# EAGLE schematic 8ModuleBoard_vr2 (EAGLE 6.3)
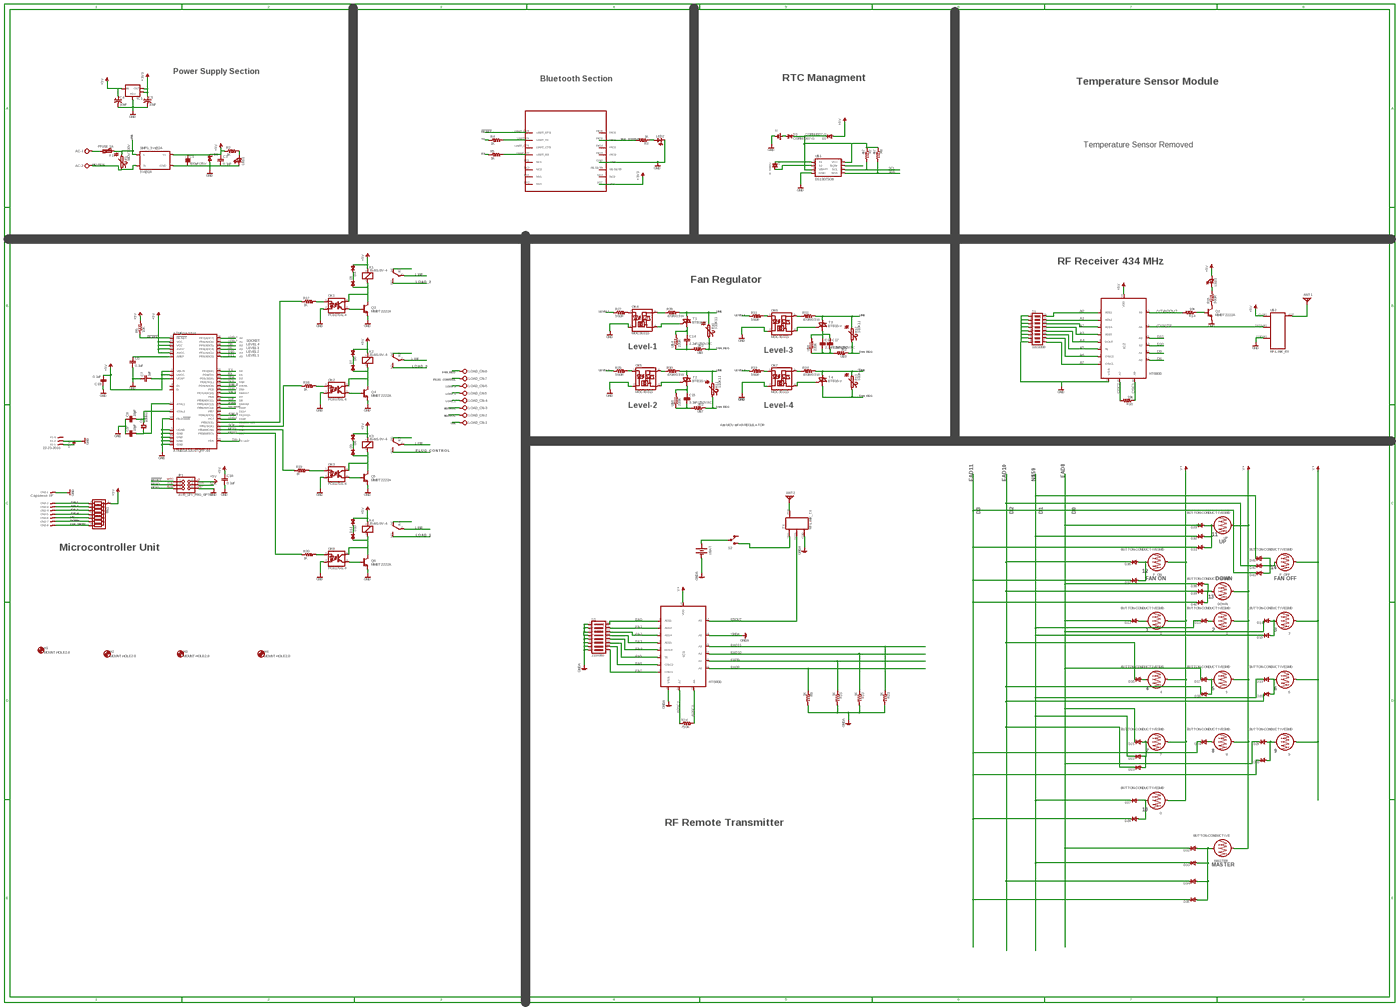
[diagram p0: schematic, sheet 1, overview]
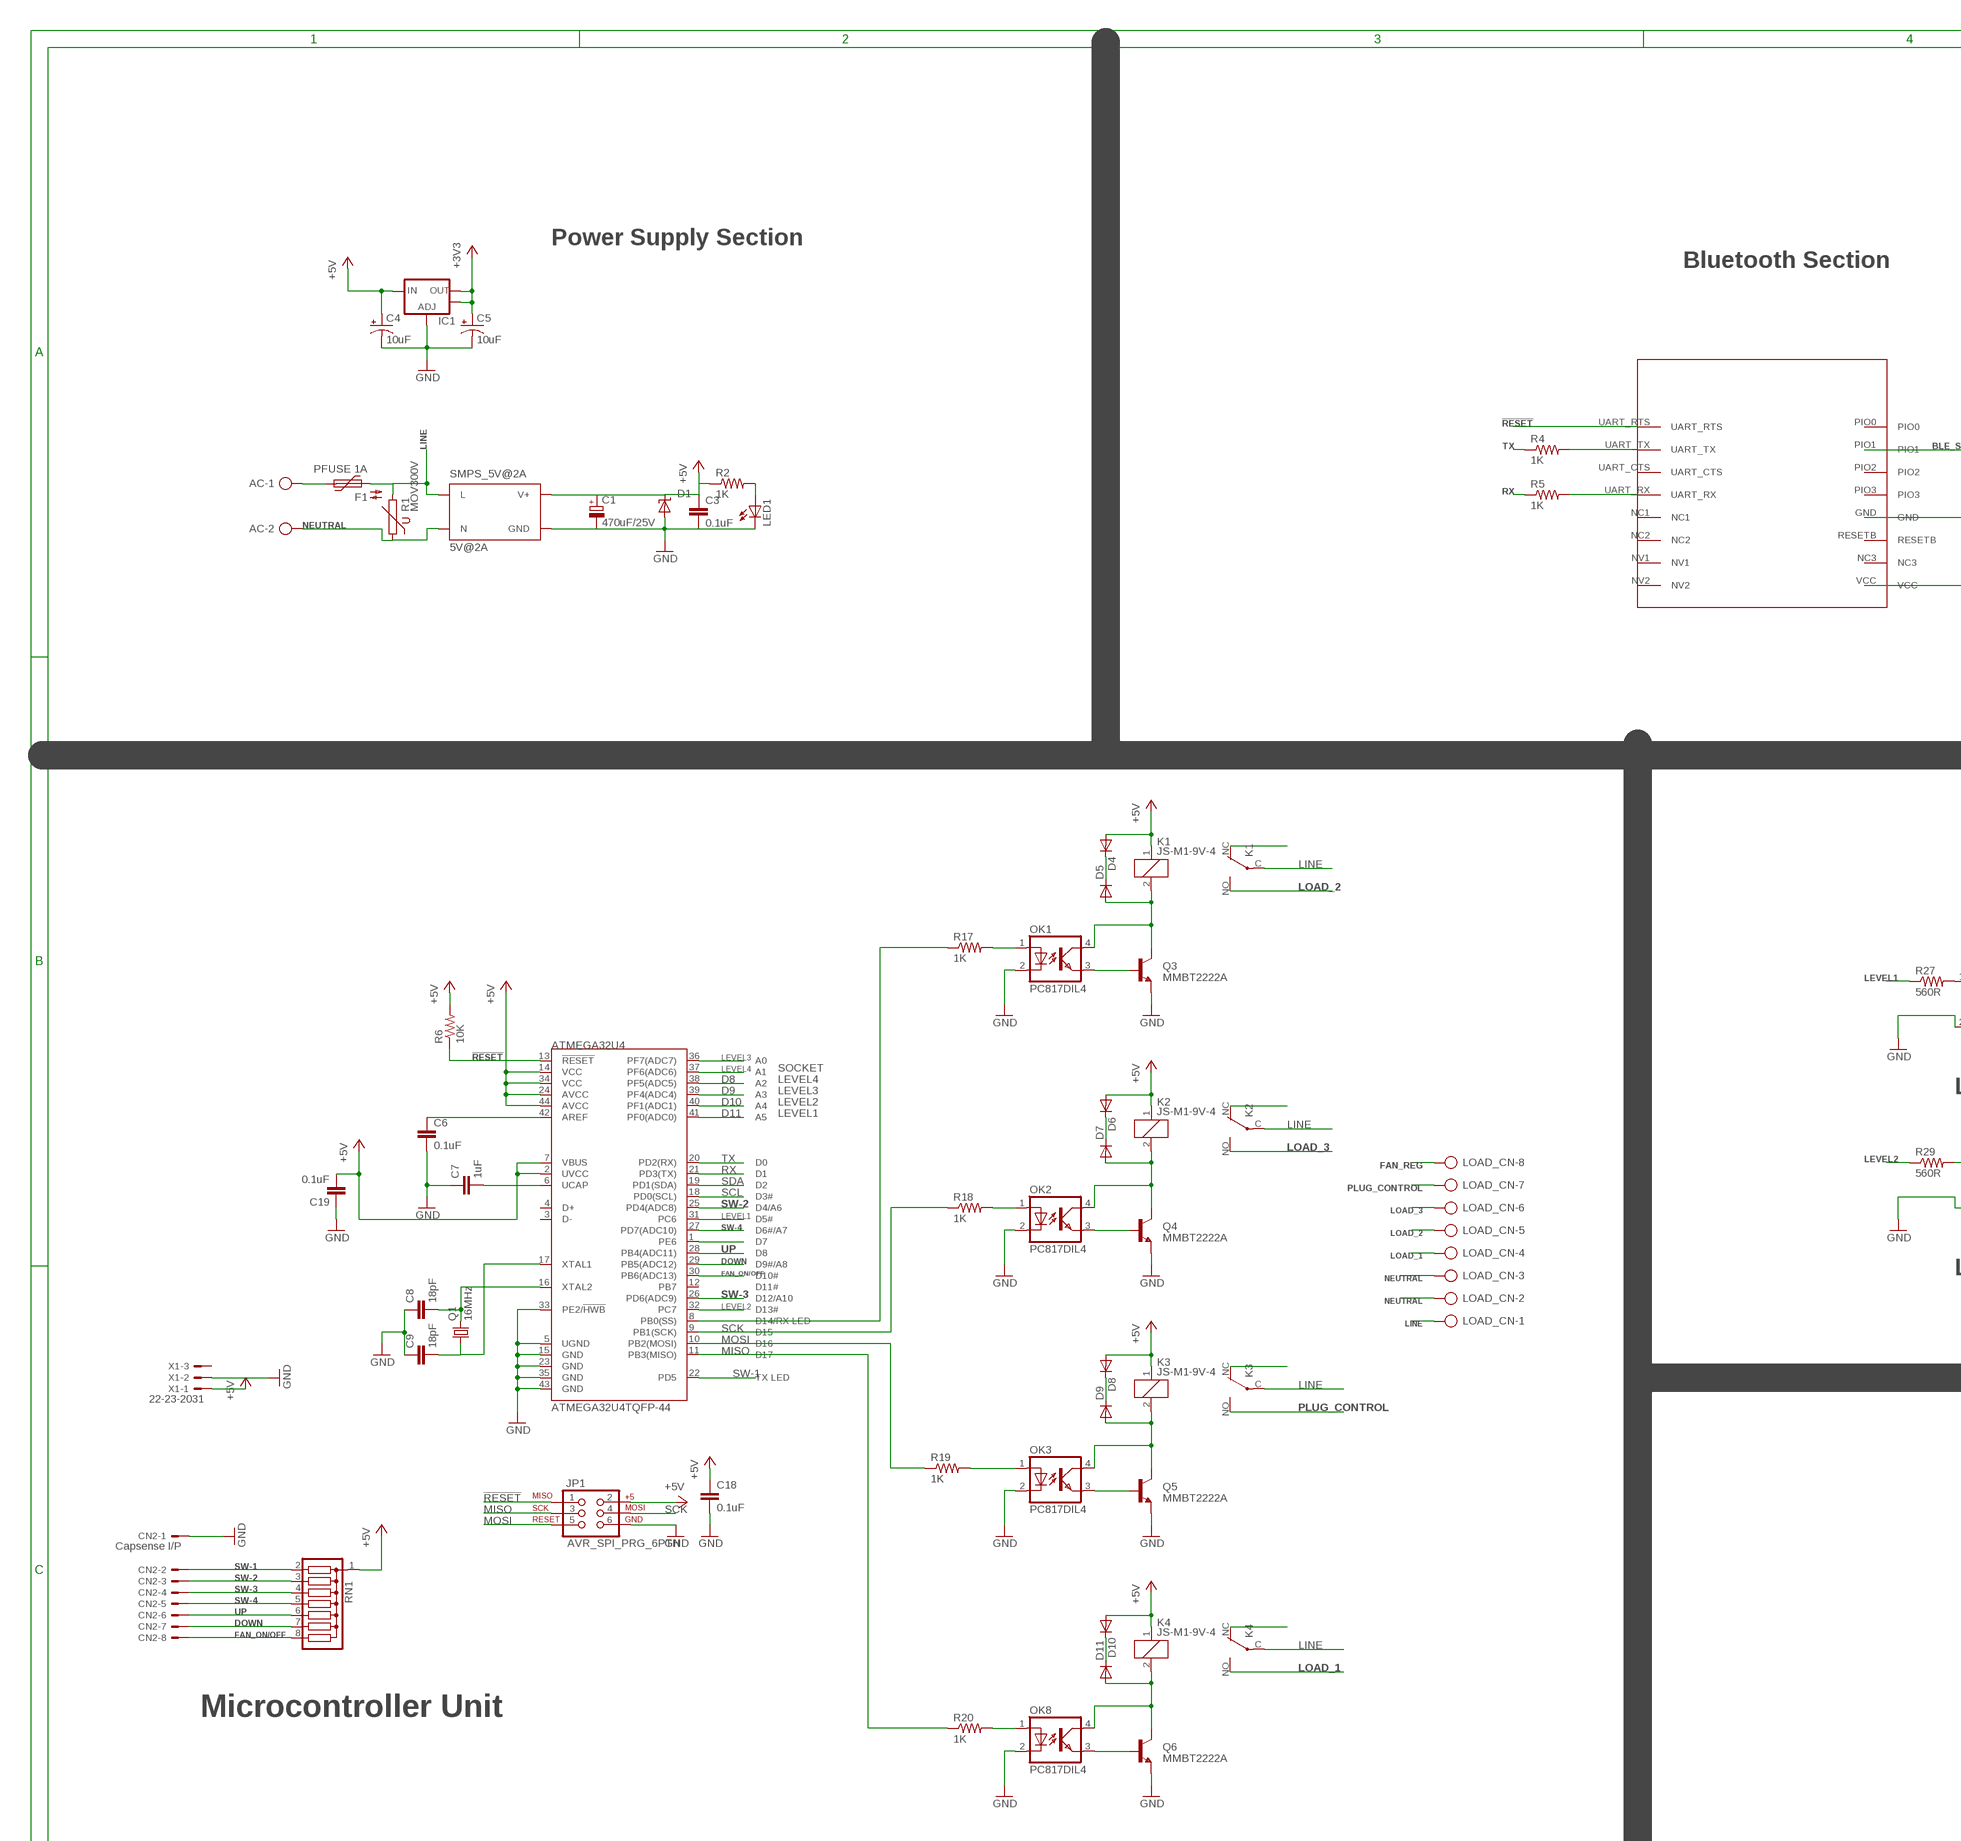
[diagram p1: schematic, sheet 1, part 1 of 4]
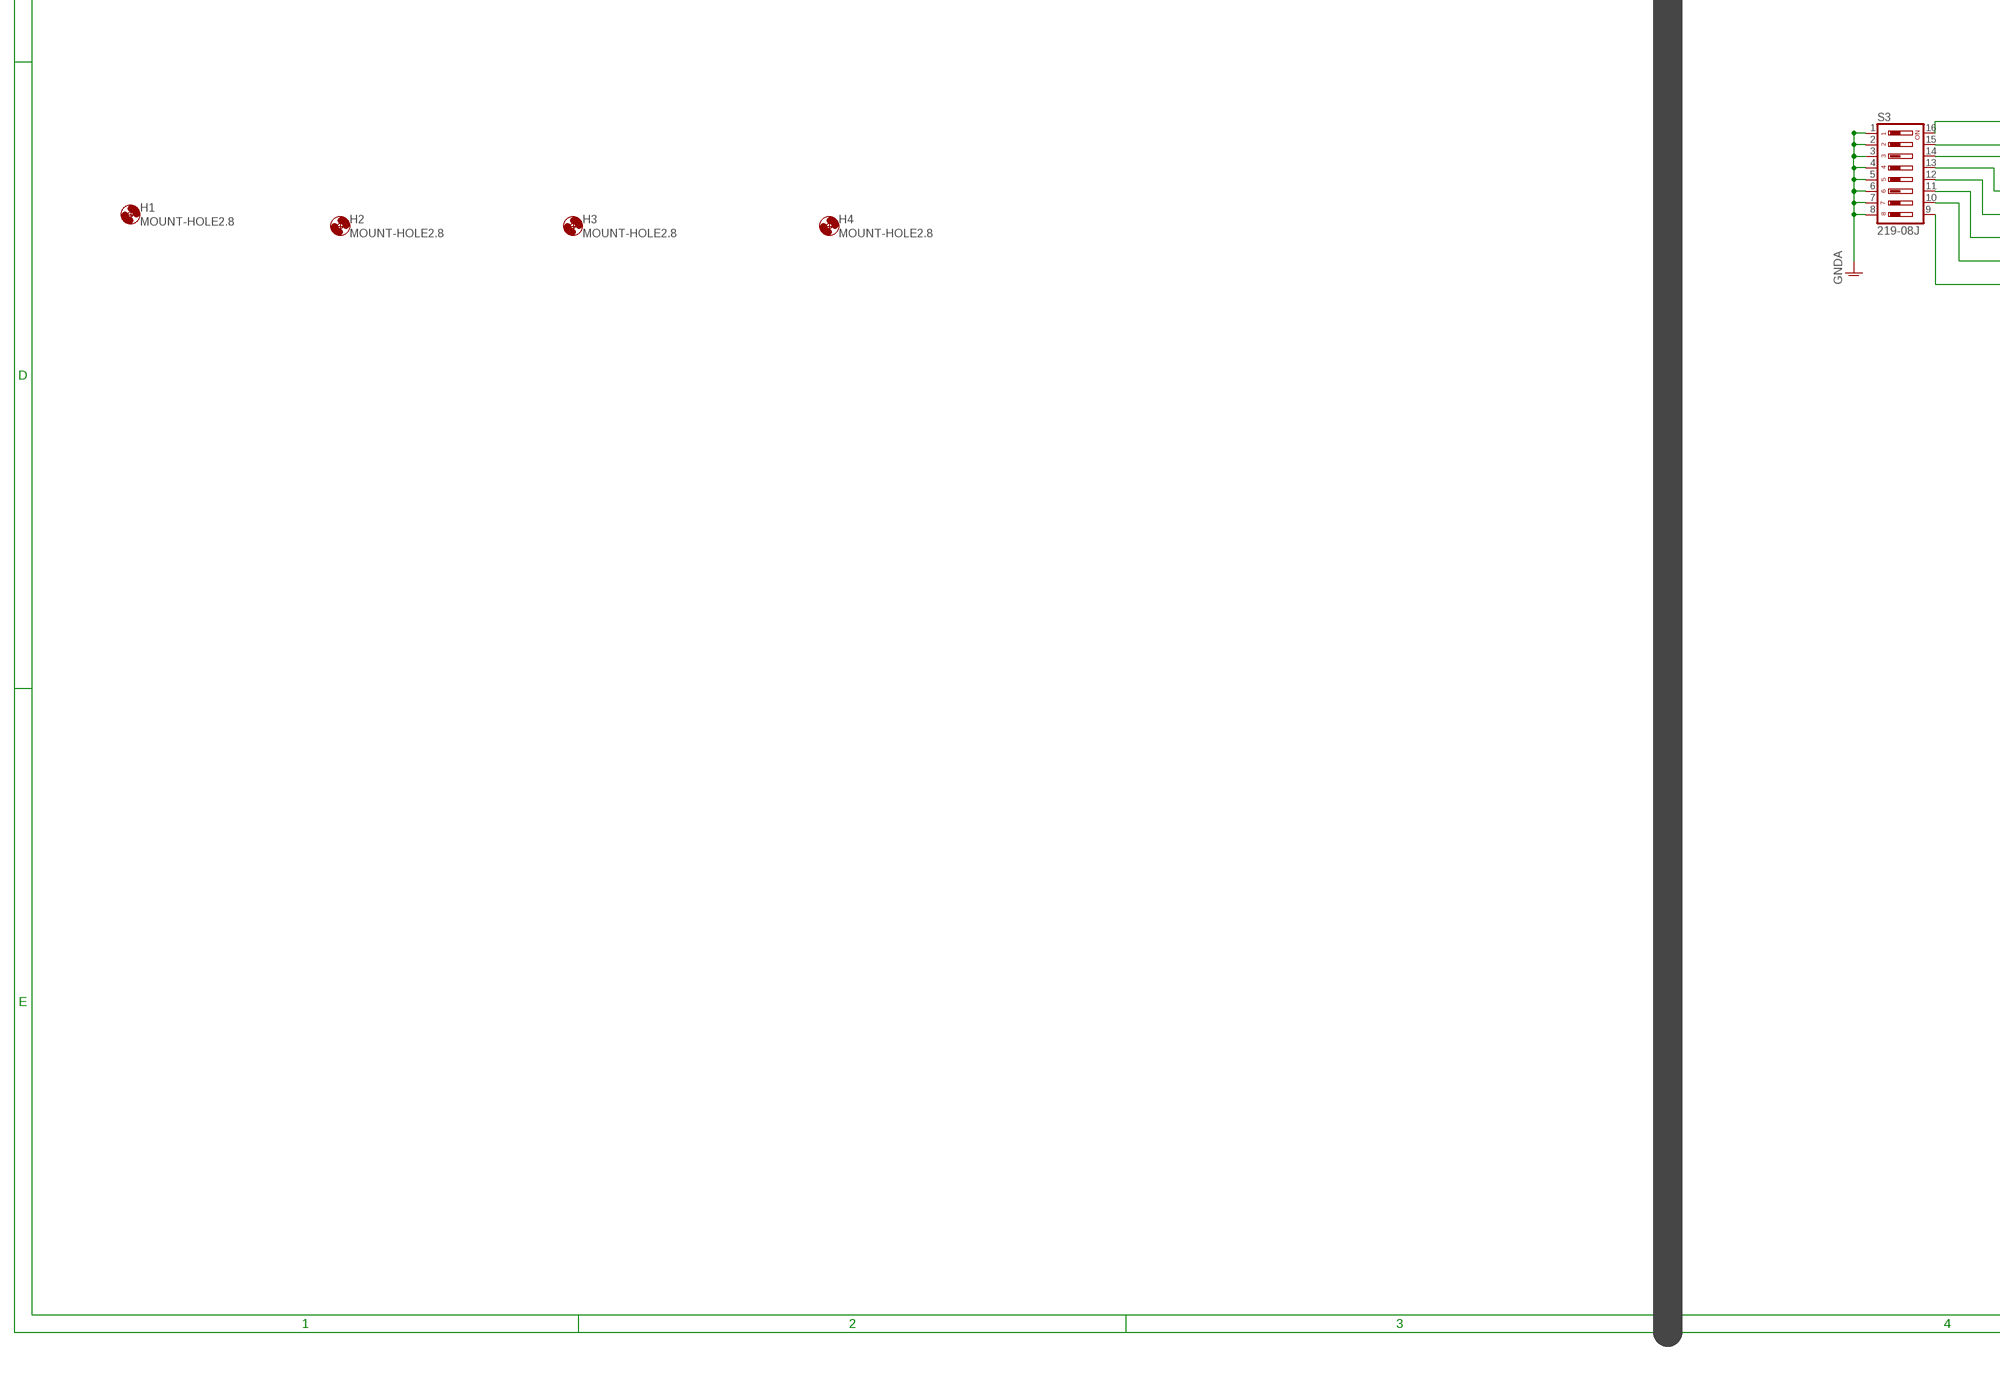
[diagram p2: schematic, sheet 1, part 2 of 4]
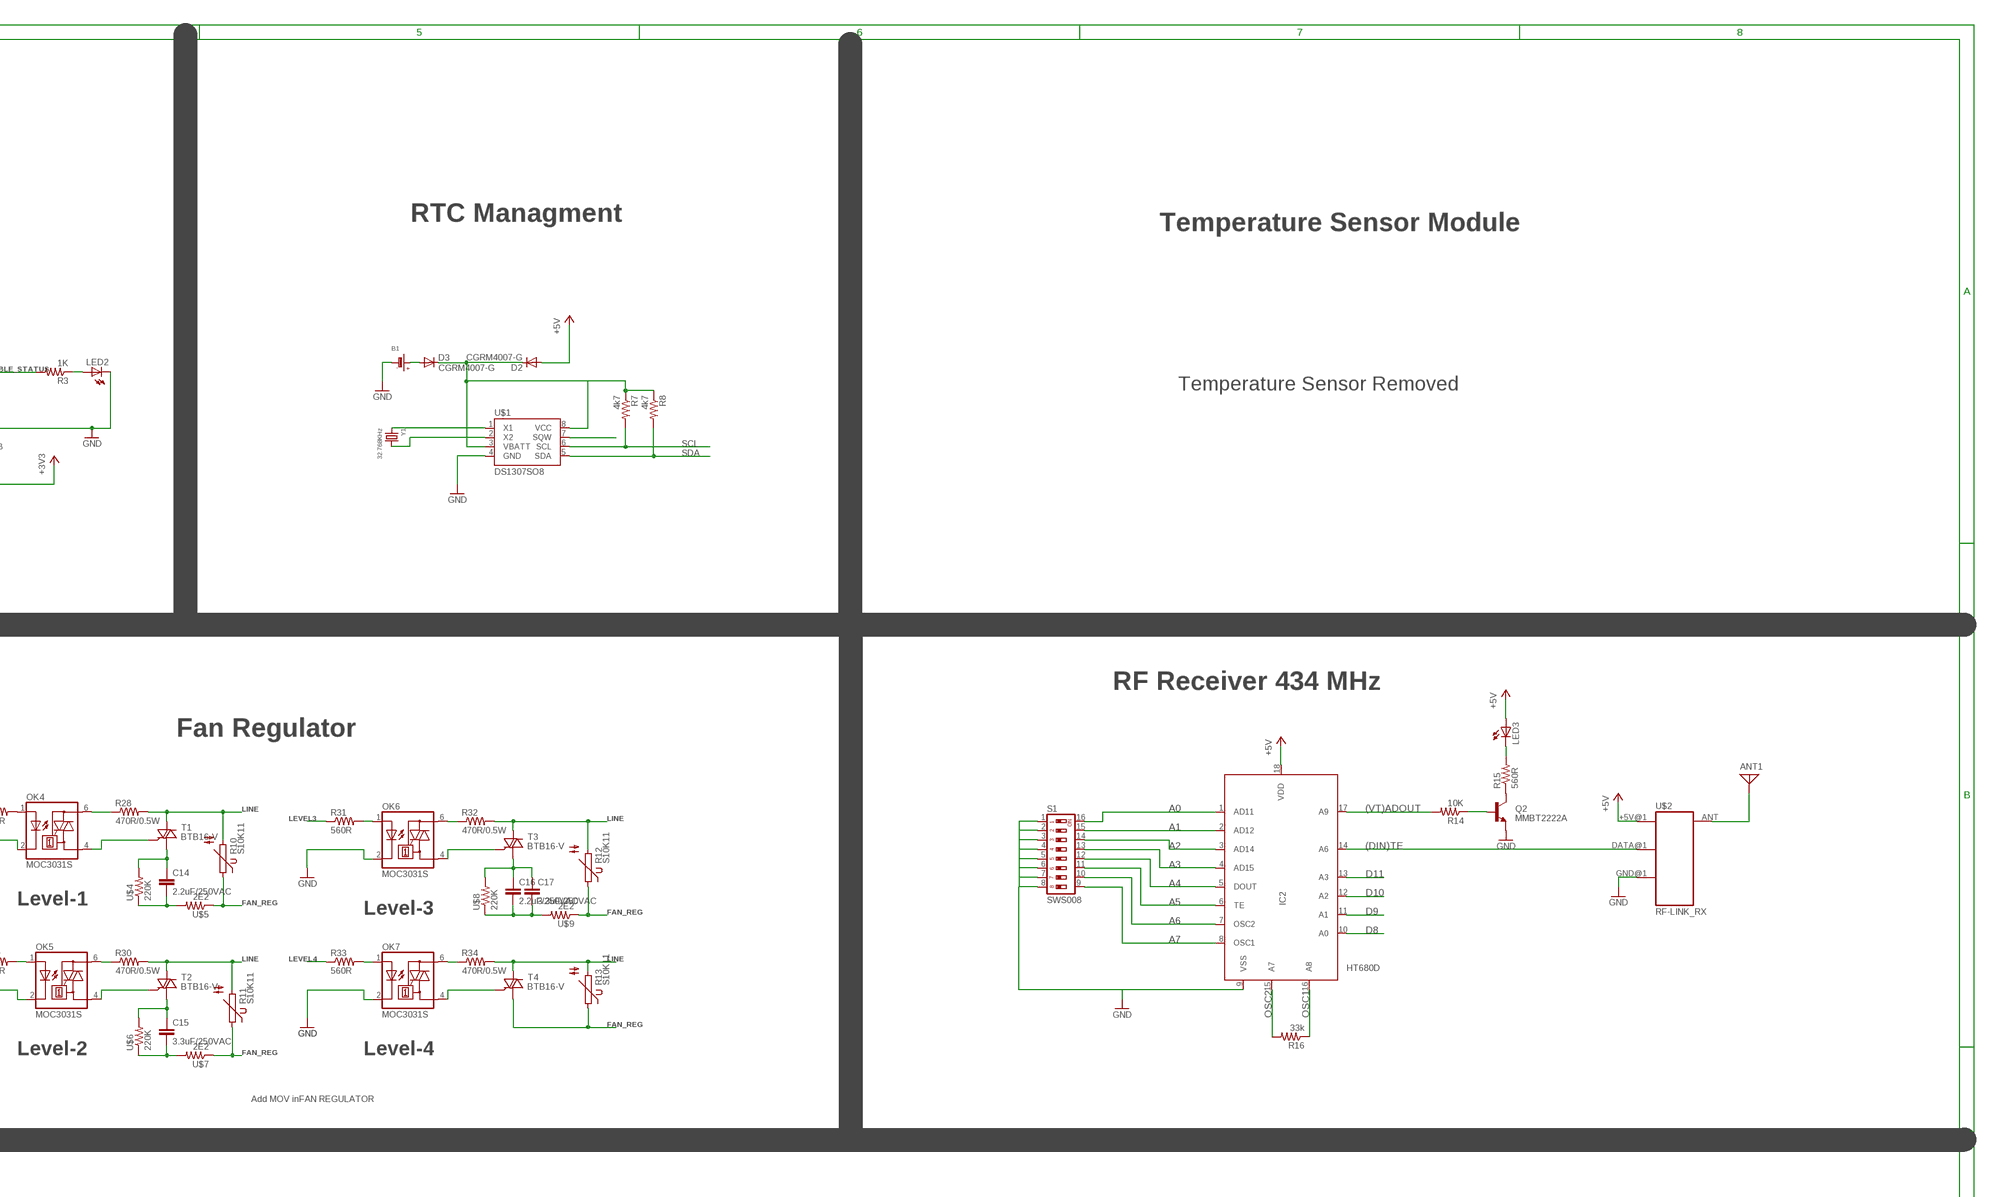
[diagram p3: schematic, sheet 1, part 3 of 4]
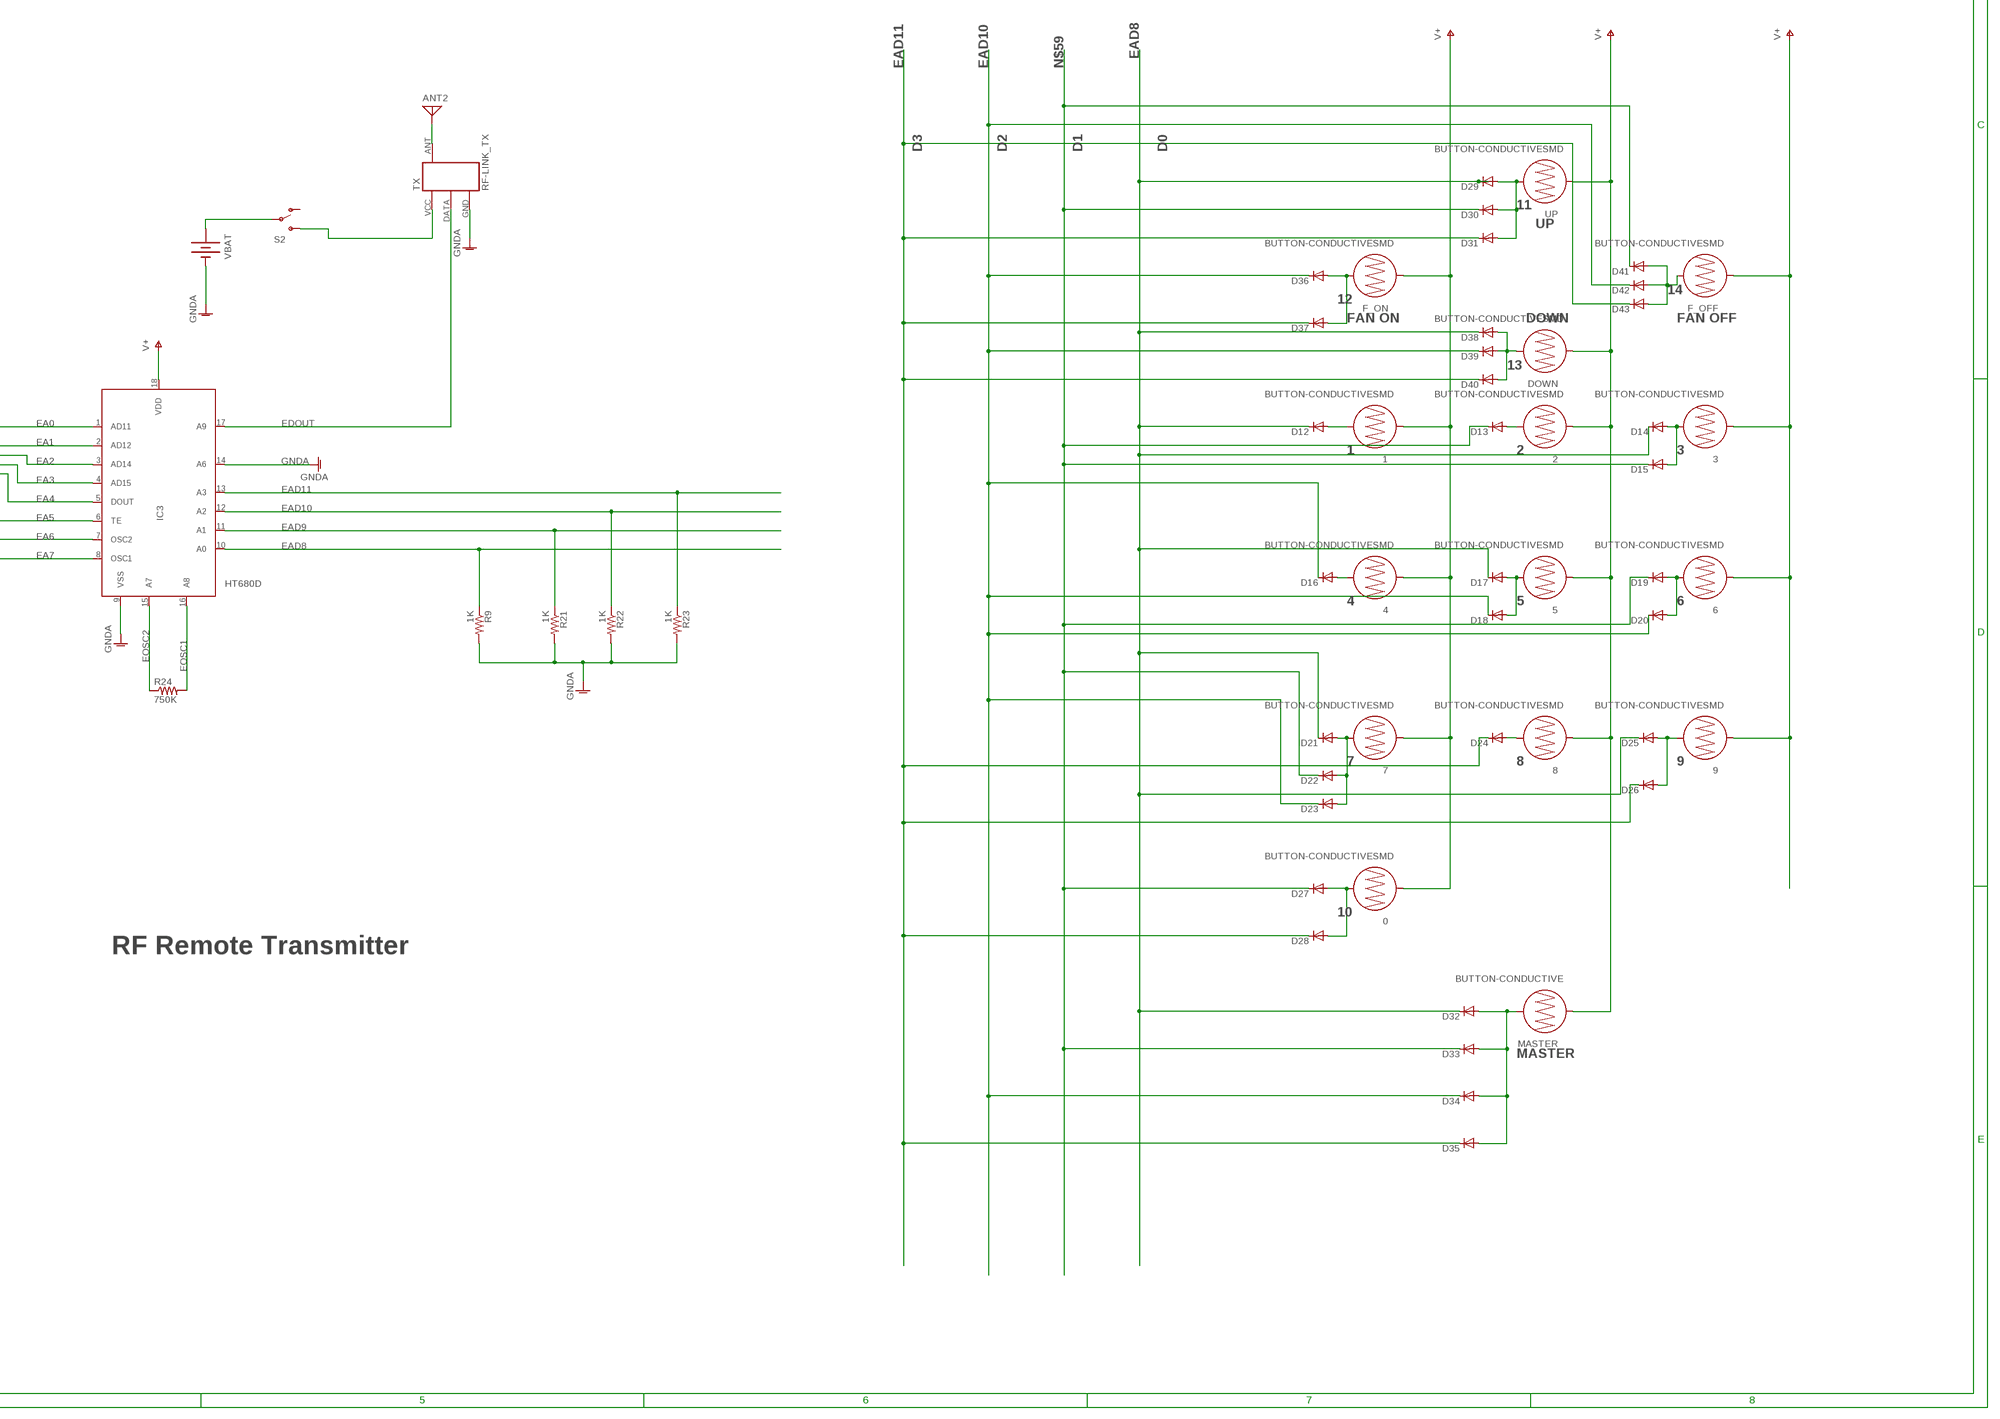
[diagram p4: schematic, sheet 1, part 4 of 4]

## Parts
0  BUTTON-CONDUCTIVESMD  [BUTTON-CONDUCTIVE]
1  BUTTON-CONDUCTIVESMD  [BUTTON-CONDUCTIVE]
2  BUTTON-CONDUCTIVESMD  [BUTTON-CONDUCTIVE]
3  BUTTON-CONDUCTIVESMD  [BUTTON-CONDUCTIVE]
4  BUTTON-CONDUCTIVESMD  [BUTTON-CONDUCTIVE]
5  BUTTON-CONDUCTIVESMD  [BUTTON-CONDUCTIVE]
6  BUTTON-CONDUCTIVESMD  [BUTTON-CONDUCTIVE]
7  BUTTON-CONDUCTIVESMD  [BUTTON-CONDUCTIVE]
8  BUTTON-CONDUCTIVESMD  [BUTTON-CONDUCTIVE]
9  BUTTON-CONDUCTIVESMD  [BUTTON-CONDUCTIVE]
AC  AK300/2  [AK300/2]
ANT1  ANTENNA  [PAD-01]
ANT2  ANTENNA  [PAD-01]
ATMEGA32U4  ATMEGA32U4TQFP-44  [TQFP44]
B1  BATTERYCR2032  [CR2032]
C1  470uF/25V  CPOL-EUE5-8.5  [E5-8,5]
C3  0.1uF  1.0UF50V10%(1206)  [1206]
C4  10uF  10UF-16V-10%(TANT)  [EIA3216]
C5  10uF  10UF-16V-10%(TANT)  [EIA3216]
C6  0.1uF  CAP1206  [1206]
C7  1uF  CAP1206  [1206]
C8  18pF  CAP1206  [1206]
C9  18pF  CAP1206  [1206]
C14  2.2uF/250VAC  C27/9  [C27.5B9]
C15  3.3uF/250VAC  C27/9  [C27.5B9]
C16  2.2uF/250VAC  C27/9  [C27.5B9]
C17  3.3uF/250VAC  C27/9  [C27.5B9]
C18  0.1uF  CAP1206  [1206]
C19  0.1uF  CAP1206  [1206]
CN2  Capsense I/P  22-23-2081  [22-23-2081]
D1  SUPPRESSOR-SMBJ  [SMBJ]
D2  CGRM4007-G  [SOD-123_MINI-SMA]
D3  CGRM4007-G  [SOD-123_MINI-SMA]
D4  DIODE-SOD123  [SOD123]
D5  DIODE-SOD123  [SOD123]
D6  DIODE-SOD123  [SOD123]
D7  DIODE-SOD123  [SOD123]
D8  DIODE-SOD123  [SOD123]
D9  DIODE-SOD123  [SOD123]
D10  DIODE-SOD123  [SOD123]
D11  DIODE-SOD123  [SOD123]
D12  DIODE-SOD123  [SOD123]
D13  DIODE-SOD123  [SOD123]
D14  DIODE-SOD123  [SOD123]
D15  DIODE-SOD123  [SOD123]
D16  DIODE-SOD123  [SOD123]
D17  DIODE-SOD123  [SOD123]
D18  DIODE-SOD123  [SOD123]
D19  DIODE-SOD123  [SOD123]
D20  DIODE-SOD123  [SOD123]
D21  DIODE-SOD123  [SOD123]
D22  DIODE-SOD123  [SOD123]
D23  DIODE-SOD123  [SOD123]
D24  DIODE-SOD123  [SOD123]
D25  DIODE-SOD123  [SOD123]
D26  DIODE-SOD123  [SOD123]
D27  DIODE-SOD123  [SOD123]
D28  DIODE-SOD123  [SOD123]
D29  DIODE-SOD123  [SOD123]
D30  DIODE-SOD123  [SOD123]
D31  DIODE-SOD123  [SOD123]
D32  DIODE-SOD123  [SOD123]
D33  DIODE-SOD123  [SOD123]
D34  DIODE-SOD123  [SOD123]
D35  DIODE-SOD123  [SOD123]
D36  DIODE-SOD123  [SOD123]
D37  DIODE-SOD123  [SOD123]
D38  DIODE-SOD123  [SOD123]
D39  DIODE-SOD123  [SOD123]
D40  DIODE-SOD123  [SOD123]
D41  DIODE-SOD123  [SOD123]
D42  DIODE-SOD123  [SOD123]
D43  DIODE-SOD123  [SOD123]
DOWN  BUTTON-CONDUCTIVESMD  [BUTTON-CONDUCTIVE]
F1  PFUSE 1A  MF-R055-5,1B  [MF-5,1B]
F_OFF  BUTTON-CONDUCTIVESMD  [BUTTON-CONDUCTIVE]
F_ON  BUTTON-CONDUCTIVESMD  [BUTTON-CONDUCTIVE]
H1  MOUNT-HOLE2.8  [2,8]
H2  MOUNT-HOLE2.8  [2,8]
H3  MOUNT-HOLE2.8  [2,8]
H4  MOUNT-HOLE2.8  [2,8]
IC1  V_REG_LM1117SOT223  [SOT223]
IC2  HT680D  [SOP18]
IC3  HT680D  [SOP18]
JP1  AVR_SPI_PRG_6PTH  [2X3]
K1  JS-M1-9V-4  [JS-M]
K2  JS-M1-9V-4  [JS-M]
K3  JS-M1-9V-4  [JS-M]
K4  JS-M1-9V-4  [JS-M]
LED1  LEDSML1206  [SML1206]
LED2  LEDSML1206  [SML1206]
LED3  LEDSML1206  [SML1206]
LOAD_CN  AK300/8  [AK300/8]
MASTER  BUTTON-CONDUCTIVE  [BUTTON-CONDUCTIVE-MINI]
OK1  PC817DIL4  [DIL4-SMD]
OK2  PC817DIL4  [DIL4-SMD]
OK3  PC817DIL4  [DIL4-SMD]
OK4  MOC3031S  [DIL6-SMD]
OK5  MOC3031S  [DIL6-SMD]
OK6  MOC3031S  [DIL6-SMD]
OK7  MOC3031S  [DIL6-SMD]
OK8  PC817DIL4  [DIL4-SMD]
Q1  16MHz  CRYSTALHC49UP  [HC49UP]
Q2  MMBT2222A  TRANSISTOR_NPNMMBT2222A  [SOT23-3]
Q3  MMBT2222A  TRANSISTOR_NPNMMBT2222A  [SOT23-3]
Q4  MMBT2222A  TRANSISTOR_NPNMMBT2222A  [SOT23-3]
Q5  MMBT2222A  TRANSISTOR_NPNMMBT2222A  [SOT23-3]
Q6  MMBT2222A  TRANSISTOR_NPNMMBT2222A  [SOT23-3]
R1  MOV300V  S10K11  [S10K11]
R2  1K  RESISTOR1206  [1206]
R3  1K  RESISTOR1206  [1206]
R4  1K  RESISTOR1206  [1206]
R5  1K  RESISTOR1206  [1206]
R6  10K  RESISTOR1206  [1206]
R7  4k7  RESISTOR1206  [1206]
R8  4k7  RESISTOR1206  [1206]
R9  1K  RESISTOR1206  [1206]
R10  S10K11  [S10K11]
R11  S10K11  [S10K11]
R12  S10K11  [S10K11]
R13  S10K11  [S10K11]
R14  10K  RESISTOR1206  [1206]
R15  560R  RESISTOR1206  [1206]
R16  33k  RESISTOR1206  [1206]
R17  1K  RESISTOR1206  [1206]
R18  1K  RESISTOR1206  [1206]
R19  1K  RESISTOR1206  [1206]
R20  1K  RESISTOR1206  [1206]
R21  1K  RESISTOR1206  [1206]
R22  1K  RESISTOR1206  [1206]
R23  1K  RESISTOR1206  [1206]
R24  750K  RESISTOR1206  [1206]
R27  560R  RESISTOR1206  [1206]
R28  470R/0.5W  R-US_0411/3V  [0411V]
R29  560R  RESISTOR1206  [1206]
R30  470R/0.5W  R-US_0411/3V  [0411V]
R31  560R  RESISTOR1206  [1206]
R32  470R/0.5W  R-US_0411/3V  [0411V]
R33  560R  RESISTOR1206  [1206]
R34  470R/0.5W  R-US_0411/3V  [0411V]
RN1  G07R  [SIL8]
S1  SWS008  [SMS-008]
S2  SWITCH-SPDT-SMD-A  [SWITCH-SPST-SMD-A]
S3  219-08J  [CTS-219-08J]
SMPS_5V@2A  5V@2A  MKS1854-6-0-404  [MKS1854-6-0-404]
T1  BTB16-V  BT138-V  [TO220BV]
T2  BTB16-V  BT138-V  [TO220BV]
T3  BTB16-V  BT138-V  [TO220BV]
T4  BTB16-V  BT138-V  [TO220BV]
TX  RF-LINK_TX  [RF-LINK_TX]
U$1  DS1307SO8  [SO08]
U$2  RF-LINK_RX  [RF-LINK_RX]
U$3  HM-11  [HM-11]
U$4  220K  RESISTOR1206  [1206]
U$5  2E2  RESISTOR1206  [1206]
U$6  220K  RESISTOR1206  [1206]
U$7  2E2  RESISTOR1206  [1206]
U$8  220K  RESISTOR1206  [1206]
U$9  2E2  RESISTOR1206  [1206]
UP  BUTTON-CONDUCTIVESMD  [BUTTON-CONDUCTIVE]
VBAT  BATTERY20SMD  [BATTCON_20MM]
X1  22-23-2031  [22-23-2031]
Y1  32.768KHz  CRYSTAL32.768  [CRYSTAL_CYL_2X6MM_SMT]

## Nets
!RESET: ATMEGA32U4.13(!RESET) JP1.1 R6.1 U$3.UART_RTS
(DIN)TE: IC2.14(A6) U$2.DATA@1(DATA)
(VT)ADOUT: IC2.17(A9) R14.2
+3V3: C5.A(+) IC1.2(OUT) IC1.4(OUT) U$3.VCC
+5V: ATMEGA32U4.2(UVCC) ATMEGA32U4.7(VBUS) ATMEGA32U4.14(VCC) ATMEGA32U4.24(AVCC) ATMEGA32U4.34(VCC) ATMEGA32U4.44(AVCC) C1.+ C3.1 C4.A(+) C18.1 C19.2 D1.C D2.A D4.A D6.A D8.A D10.A IC1.3(IN) IC2.18(VDD) JP1.2 K1.1 K2.1 K3.1 K4.1 LED3.A R2.1 R6.2 RN1.1 SMPS_5V@2A.3(V+) U$2.+5V@1(+5V) X1.1
A0: IC2.1(AD11) S1.16
A1: IC2.2(AD12) S1.15
A2: IC2.3(AD14) S1.14
A3: IC2.4(AD15) S1.13
A4: IC2.5(DOUT) S1.12
A5: IC2.6(TE) S1.11
A6: IC2.7(OSC2) S1.10
A7: IC2.8(OSC1) S1.9
BLE_STATUS: R3.2 U$3.PIO1
D8: ATMEGA32U4.38(PF5(ADC5)) IC2.10(A0)
D9: ATMEGA32U4.39(PF4(ADC4)) IC2.11(A1)
D10: ATMEGA32U4.40(PF1(ADC1)) IC2.12(A2)
D11: ATMEGA32U4.41(PF0(ADC0)) IC2.13(A3)
DOWN: ATMEGA32U4.29(PB5(ADC12)) CN2.7 RN1.7
EA0: IC3.1(AD11) S3.16
EA1: IC3.2(AD12) S3.15
EA2: IC3.3(AD14) S3.14
EA3: IC3.4(AD15) S3.13
EA4: IC3.5(DOUT) S3.12
EA5: IC3.6(TE) S3.11
EA6: IC3.7(OSC2) S3.10
EA7: IC3.8(OSC1) S3.9
EAD8: D12.C D14.C D17.C D21.C D25.C D29.C D32.C D38.C IC3.10(A0) R9.1
EAD9: IC3.11(A1) R21.1
EAD10: D16.C D18.C D20.C D23.C D34.C D36.C D39.C D42.C IC3.12(A2) R22.1
EAD11: D24.C D26.C D28.C D31.C D35.C D37.C D40.C D43.C IC3.13(A3) R23.1
EDOUT: IC3.17(A9) TX.DATA
EOSC1: IC3.16(A8) R24.2
EOSC2: IC3.15(A7) R24.1
FAN_ON/OFF: ATMEGA32U4.30(PB6(ADC13)) CN2.8 RN1.8
FAN_REG: LOAD_CN.8 R10.1 R11.1 R12.1 R13.1 T4.T1(A1) U$5.1 U$7.1 U$9.1
GND: ATMEGA32U4.5(UGND) ATMEGA32U4.15(GND) ATMEGA32U4.23(GND) ATMEGA32U4.33(PE2/!HWB) ATMEGA32U4.35(GND) ATMEGA32U4.43(GND) B1.- C1.- C3.2 C4.C(-) C5.C(-) C6.2 C7.1 C8.1 C9.1 C18.2 C19.1 CN2.1 D1.A IC1.1(ADJ) IC2.9(VSS) JP1.6 LED1.C LED2.C OK1.2(C) OK2.2(C) OK3.2(C) OK4.2(C) OK5.2(C) OK6.2(C) OK7.2(C) OK8.2(C) Q2.2(E) Q3.2(E) Q4.2(E) Q5.2(E) Q6.2(E) S1.1 S1.2 S1.3 S1.4 S1.5 S1.6 S1.7 S1.8 SMPS_5V@2A.4(GND) U$1.4(GND) U$2.GND@1(GND) U$3.GND X1.2
GNDA: IC3.9(VSS) IC3.14(A6) R9.2 R21.2 R22.2 R23.2 S3.1 S3.2 S3.3 S3.4 S3.5 S3.6 S3.7 S3.8 TX.GND VBAT.2(-)
LEVEL1: ATMEGA32U4.31(PC6) R27.1
LEVEL2: ATMEGA32U4.32(PC7) R29.1
LEVEL3: ATMEGA32U4.36(PF7(ADC7)) R31.1
LEVEL4: ATMEGA32U4.37(PF6(ADC6)) R33.1
LINE: F1.1 K1.C(2:P) K2.C(2:P) K3.C(2:P) K4.C(2:P) LOAD_CN.1 R1.2 R10.2 R11.2 R12.2 R13.2 R28.2 R30.2 R32.2 R34.2 SMPS_5V@2A.1(L) T1.T2(A2) T2.T2(A2) T3.T2(A2) T4.T2(A2)
LOAD_1: K4.NO(2:S) LOAD_CN.4
LOAD_2: K1.NO(2:S) LOAD_CN.5
LOAD_3: K2.NO(2:S) LOAD_CN.6
MISO: ATMEGA32U4.11(PB3(MISO)) JP1.3 R20.1
MOSI: ATMEGA32U4.10(PB2(MOSI)) JP1.5 R19.1
N$1: OK6.1(A) R31.2
N$2: OK4.1(A) R27.2
N$3: OK5.1(A) R29.2
N$4: OK4.6(A2) R28.1
N$5: OK7.1(A) R33.2
N$6: R4.2 U$3.UART_TX
N$7: ATMEGA32U4.6(UCAP) C7.2
N$8: Q2.1(B) R14.1
N$9: LED2.A R3.1
N$10: ATMEGA32U4.42(AREF) C6.1
N$11: R5.2 U$3.UART_RX
N$12: U$1.1(X1) Y1.1
N$13: U$1.2(X2) Y1.2
N$14: D2.C D3.C R7.1 R8.1 U$1.3(VBATT) U$1.8(VCC)
N$15: LED1.A R2.2
N$16: B1.+ D3.A
N$17: 1.2 D12.A
N$18: 2.2 D13.A
N$19: U$1.7(SQW)
N$20: ATMEGA32U4.1(PE6)
N$22: ATMEGA32U4.16(XTAL2) C8.2 Q1.2
N$23: ATMEGA32U4.17(XTAL1) C9.2 Q1.1
N$24: Q2.3(C) R15.1
N$26: S2.2(P) VBAT.1(+)
N$27: LED3.C R15.2
N$28: S2.3(S) TX.VCC(+5V)
N$29: OK5.6(A2) R30.1
N$30: OK6.6(A2) R32.1
N$31: ANT1.1 U$2.ANT
N$32: OK1.3(EMIT) Q3.1(B)
N$33: D5.A K1.2 OK1.4(COL) Q3.3(C)
N$34: OK7.6(A2) R34.1
N$35: 3.2 D14.A D15.A
N$36: AC.1 F1.2
N$37: D4.C D5.C
N$38: K1.NC(2:O)
N$40: ANT2.1 TX.ANT
N$41: OK1.1(A) R17.2
N$42: 4.2 D16.A
N$43: OK2.3(EMIT) Q4.1(B)
N$44: 5.2 D17.A D18.A
N$45: D7.A K2.2 OK2.4(COL) Q4.3(C)
N$46: D6.C D7.C
N$47: K2.NC(2:O)
N$48: 6.2 D19.A D20.A
N$49: 7.2 D21.A D22.A D23.A
N$50: OK2.1(A) R18.2
N$51: OK3.3(EMIT) Q5.1(B)
N$52: 0.2 D27.A D28.A
N$53: D9.A K3.2 OK3.4(COL) Q5.3(C)
N$54: OK4.4(A1) T1.G
N$55: C14.1 T1.T1(A1) U$4.2
N$56: C14.2 U$4.1 U$5.2
N$57: D8.C D9.C
N$58: K3.NC(2:O)
N$59: D13.C D15.C D19.C D22.C D27.C D30.C D33.C D41.C
N$60: D29.A D30.A D31.A UP.2
N$61: 8.2 D24.A
N$62: OK5.4(A1) T2.G
N$63: C15.1 T2.T1(A1) U$6.2
N$64: C15.2 U$6.1 U$7.2
N$65: OK3.1(A) R19.2
N$66: OK8.3(EMIT) Q6.1(B)
N$67: D11.A K4.2 OK8.4(COL) Q6.3(C)
N$68: D36.A D37.A F_ON.2
N$69: D10.C D11.C
N$70: OK6.4(A1) T3.G
N$71: C16.1 C17.1 T3.T1(A1) U$8.2
N$72: C16.2 C17.2 U$8.1 U$9.2
N$73: K4.NC(2:O)
N$74: 9.2 D25.A D26.A
N$75: D38.A D39.A D40.A DOWN.2
N$76: D32.A D33.A D34.A D35.A MASTER.2
N$77: OK8.1(A) R20.2
N$78: OK7.4(A1) T4.G
N$79: D41.A D42.A D43.A F_OFF.2
N$83: ATMEGA32U4.8(PB0(SS)) R17.1
NEUTRAL: AC.2 LOAD_CN.2 LOAD_CN.3 R1.1 SMPS_5V@2A.2(N)
OSC1: IC2.16(A8) R16.1
OSC2: IC2.15(A7) R16.2
PLUG_CONTROL: K3.NO(2:S) LOAD_CN.7
RX: ATMEGA32U4.21(PD3(TX)) R5.1
SCK: ATMEGA32U4.9(PB1(SCK)) JP1.4 R18.1
SCL: ATMEGA32U4.18(PD0(SCL)) R7.2 U$1.6(SCL)
SDA: ATMEGA32U4.19(PD1(SDA)) R8.2 U$1.5(SDA)
SW-1: ATMEGA32U4.22(PD5) CN2.2 RN1.2
SW-2: ATMEGA32U4.25(PD4(ADC8)) CN2.3 RN1.3
SW-3: ATMEGA32U4.26(PD6(ADC9)) CN2.4 RN1.4
SW-4: ATMEGA32U4.27(PD7(ADC10)) CN2.5 RN1.5
TX: ATMEGA32U4.20(PD2(RX)) R4.1
UP: ATMEGA32U4.28(PB4(ADC11)) CN2.6 RN1.6
V+: 0.1 1.1 2.1 3.1 4.1 5.1 6.1 7.1 8.1 9.1 DOWN.1 F_OFF.1 F_ON.1 IC3.18(VDD) MASTER.1 UP.1
Unconnected: ATMEGA32U4.3(D-) ATMEGA32U4.4(D+) ATMEGA32U4.12(PB7) S2.1(O) U$3.NC1 U$3.NC2 U$3.NC3 U$3.NV1 U$3.NV2 U$3.PIO0 U$3.PIO2 U$3.PIO3 U$3.RESETB U$3.UART_CTS X1.3

## Notes on the sheet
- Power Supply Section
- Bluetooth Section | RTC Managment
- Temperature Sensor Module
- Temperature Sensor Removed
- RF Receiver 434 MHz
- Fan Regulator
- SOCKET
- LEVEL4
- LEVEL3 | Level-1
- LEVEL2 | Level-3
- LEVEL1
- Level-2 | Level-4
- Add MOV inFAN REGULATOR
- D3 | D2 | D1 | D0
- 11
- UP
- Microcontroller Unit
- 14
- 12
- FAN ON | DOWN | FAN OFF
- 13
- 1 | 2 | 3
- 4 | 5 | 6
- 7 | 8 | 9
- 10
- RF Remote Transmitter
- MASTER

## Library data of the parts
0 1-9 DOWN F_OFF F_ON MASTER UP = SparkFun-Electromechanical:BUTTON-CONDUCTIVE: Used with rubber key pads. This one was designed and proven to work with the PolyCase Key FOB enclosures.
AC = con-ptr500:AK300/2: CONNECTOR; OC_FARNELL: unknown; OC_NEWARK: unknown
ANT1 ANT2 = discrete:ANTENNA: Antenna
ATMEGA32U4 = SparkFun-DigitalIC:ATMEGA32U4: Atmel 44-pin 8-bit Microcontroller with 32KBytes of ISP Flash and USB Controller
B1 = microbuilder:BATTERY: CR1220 SMT - Digikey: 3001K-ND
C1 = rcl:CPOL-EU: POLARIZED CAPACITOR, European symbol
C3 = SparkFun-Capacitors:1.0UF50V10%(1206): CAP-09822; PROD_ID: CAP-09822; VALUE: 1.0uF
C4 C5 = SparkFun-Capacitors:10UF-16V-10%(TANT): CAP-00811 1206/EIA-3216 Tantalum capacitor; PROD_ID: CAP-00811
C6-C9 C18 C19 = SparkFun-Passives:CAP: Capacitor Standard 0603 ceramic capacitor, and 0.1" leaded capacitor.
C14-C17 = capacitor-wima:C: CAPACITOR naming: grid - package width
CN2 = con-molex:22-23-2081: .100" (2.54mm) Center Header - 8 Pin; MF: MOLEX; MPN: 22-23-2081; OC_FARNELL: 1756826; OC_NEWARK: 01C7592
D1 = diode:SUPPRESSOR-: Suppressor diode
D2 D3 = diode:CGRM400*-G: Molded plasitc,JEDEC SOD-123/Mini SMA Source: Comchip CGRM4001-G.pdf
D4-D43 = diode:DIODE-: DIODE
F1 = bourns:MF-R055: MultiFuse Polyfuse Overcurrent Protectors
H1-H4 = holes:MOUNT-HOLE: MOUNTING HOLE with drill center marker
IC1 = SparkFun-PowerIC:V_REG_LM1117: Voltage Regulator LM1117 Standard adjustable voltage regulator but in SMD form. Spark Fun Electronics SKU : COM-00595; PROD_ID: VREG-08170
IC2 IC3 = holtek:HT680: 318 Series of Encoders TE trigger type Source: http://www.holtek.com.tw/pdf/consumer/3_18ev110.pdf; OC_FARNELL: unknown; OC_NEWARK: unknown
JP1 = SparkFun-Connectors:AVR_SPI_PRG_6: AVR ISP 6 Pin This is the reduced ISP connector for AVR programming. Common on Arduino. This footprint will take up less PCB space and can be used with a 10-pin to 6-pin adapter such as SKU: BOB-08508 **Special note about "TEST_POINT" package. The stop mask is on the top side, so if you want your programming test points to be on the bottom of your board, make sure to place this package on the bottom side of the board. This also ensure that the orientation to program from the bottom side will be correct.
K1-K4 = relay:JS-M1*: Automotive Ultra-Miniature Power Relay NAiS Source: http://www.mew-europe.com/.. en_ds_61211_0000.pdf; OC_FARNELL: unknown; OC_NEWARK: unknown
LED1-LED3 = led:LED: LED OSRAM: - CHIPLED LG R971, LG N971, LY N971, LG Q971, LY Q971, LO R971, LY R971 LH N974, LH R974 LS Q976, LO Q976, LY Q976 LO Q996 - Hyper CHIPLED LW Q18S LB Q993, LB Q99A, LB R99A - SideLED LS A670, LO A670, LY A670, LG A670, LP A670 LB A673, LV A673, LT A673, LW A673 LH A674 LY A675 LS A676, LA A676, LO A676, LY A676, LW A676 LS A679, LY A679, LG A679 - Hyper Micro SIDELED® LS Y876, LA Y876, LO Y876, LY Y876 LT Y87S - SmartLED LW L88C, LW L88S LB L89C, LB L89S, LG L890 LS L89K, LO L89K, LY L89K LS L896, LA L896, LO L896, LY L896 - TOPLED LS T670, LO T670, LY T670, LG T670, LP T670 LSG T670, LSP T670, LSY T670, LOP T670, LYG T670 LG T671, LOG T671, LSG T671 LB T673, LV T673, LT T673, LW T673 LH T674 LS T676, LA T676, LO T676, LY T676, LB T676, LH T676, LSB T676, LW T676 LB T67C, LV T67C, LT T67C, LS T67K, LO T67K, LY T67K, LW E67C LS E67B, LA E67B, LO E67B, LY E67B, LB E67C, LV E67C, LT E67C LW T67C LS T679, LY T679, LG T679 LS T770, LO T770, LY T770, LG T770, LP T770 LB T773, LV T773, LT T773, LW T773 LH T774 LS E675, LA E675, LY E675, LS T675 LS T776, LA T776, LO T776, LY T776, LB T776 LHGB T686 LT T68C, LB T68C - Hyper Mini TOPLED® LB M676 - Mini TOPLED Santana® LG M470 LS M47K, LO M47K, LY M47K Source: http://www.osram.convergy.de LUXEON: - LUMILED® LXK2-PW12-R00, LXK2-PW12-S00, LXK2-PW14-U00, LXK2-PW14-V00 LXK2-PM12-R00, LXK2-PM12-S00, LXK2-PM14-U00 LXK2-PE12-Q00, LXK2-PE12-R00, LXK2-PE12-S00, LXK2-PE14-T00, LXK2-PE14-U00 LXK2-PB12-K00, LXK2-PB12-L00, LXK2-PB12-M00, LXK2-PB14-N00, LXK2-PB14-P00, LXK2-PB14-Q00 LXK2-PR12-L00, LXK2-PR12-M00, LXK2-PR14-Q00, LXK2-PR14-R00 LXK2-PD12-Q00, LXK2-PD12-R00, LXK2-PD12-S00 LXK2-PH12-R00, LXK2-PH12-S00 LXK2-PL12-P00, LXK2-PL12-Q00, LXK2-PL12-R00 Source: www.luxeon.com KINGBRIGHT: KA-3528ASYC Source: www.kingbright.com
LOAD_CN = con-ptr500:AK300/8: CONNECTOR; OC_FARNELL: unknown; OC_NEWARK: unknown
OK1-OK3 OK8 = optocoupler:PC817: SHARP OPTO COUPLER
OK4-OK7 = optocoupler:MOC30*: 6-Pin DIP Zero-Cross Optoisolators Triac Driver Output (250/400 Volt Peak) Source: Data sheet <http://www.fairchildsemi.com/ds/MO/MOC3031M.pdf> The old path of data sheet not more available 2013-05-06.; MF: FAIRCHILD SEMICONDUCTOR; MPN: MOC3031SM; OC_FARNELL: unknown; OC_NEWARK: 34C1335
Q1 = crystal:CRYSTAL: CRYSTAL; OC_FARNELL: unknown; OC_NEWARK: unknown
Q2-Q6 = SparkFun-DiscreteSemi:TRANSISTOR_NPN: Generic NPN BJT MMBT2222A - TRANS-08049 (SOT-23, 1A 40V) MPSA42 - TRANS-09116 (SOT-23, 500mA 300V) MMBT5088LT1G - TRANS-11160 (SOT-23, 50 mA 30V) BC547 - COM-08928 <http://www.sparkfun.com/products/8928> (TO-92 45V 100mA) (1.Collector 2.Base 3.Emitter) 2N3904 - COM-00521 <http://www.sparkfun.com/products/521> (TO-92 40V 200mA) (1.Emitter 2.Base 3.Collector) P2N2222A - COM-12852 <http://www.sparkfun.com/products/12852> (TO-92 40V 600mA) (1.Collector 2.Base 3.Emitter); PROD_ID: TRANS-08049
R1 R10-R13 = varistor:S10K11: VARISTOR
R2 R4 R5 R15-R20 R27 R29 R31 R33 U$4-U$9 = SparkFun-Resistors:RESISTOR: Resistor Basic schematic elements and footprints for 0603, 1206, and PTH resistors.
R3 R6-R9 R14 R21-R24 = SparkFun-Passives:RESISTOR: Resistor Basic schematic elements and footprints for 0603, 1206, and PTH resistors.
R28 R30 R32 R34 = rcl:R-US_: RESISTOR, American symbol
RN1 = resistor-sil:G07R: SIL RESISTOR; OC_FARNELL: unknown; OC_NEWARK: unknown
S1 = smd-special:SWS008: SMD Dip Switch 8 pol.
S2 = SparkFun-Electromechanical:SWITCH-SPDT: SPDT Switch Simple slide switch, Spark Fun Electronics SKU : COM-00102 DPDT SMT slide switch, AYZ0202, SWCH-08179
S3 = switch-dil:219-08*: Surface Mount DIP Switch Series 219 SMT CTS Electronic Components Sourc: www.ctscorp.com; OC_FARNELL: unknown; OC_NEWARK: unknown
SMPS_5V@2A = Morsun-con-stocko:MKS1854-6-0-404: Serie MKS 1850 Lötstifte In-line, Raster 2.5 mm, Stiftwannen, stehend, mit Rastlasche Source: http://www.stocko.de/de/index.php?seite=ka_rfk2_mks1850.html&rubrik=Katalog+-+RFK+2 rfk_1850.pdf; OC_FARNELL: 1141862; OC_NEWARK: unknown
T1-T4 = triac:BT138: TRIAC Source: http://www.semiconductors.philips.com BT138_SERIES_2.pdf
TX = SparkFun-RF:RF-LINK_TX: RF Link transmitters WRL-8945, 8946
U$1 = SparkFun-FreqCtrl:DS1307: I2C real-time clock with battery backup.
U$2 = SparkFun-RF:RF-LINK_RX: RF Link receivers- WRL-8947, 8948, 8949, 8950, 10532, 10533
U$3 = HM-11:HM-11
VBAT = SparkFun-Electromechanical:BATTERY: Battery Holders Various common sizes : AA, AAA, 18650 (PRT-12895), 20mm coin cell and 12mm coin cell. 20MM_4LEGS, BATT-10373
X1 = con-molex:22-23-2031: .100" (2.54mm) Center Header - 3 Pin; MF: MOLEX; MPN: 22-23-2031; OC_FARNELL: 1462950; OC_NEWARK: 30C0862
Y1 = microbuilder:CRYSTAL: Crystals HC49UP - Surface Mount Crystal 4.0MHz 18pF +/-30ppm Surface Mount Crystal [Digikey: 535-9857-1-ND] 12.0 MHz Surface Mount Crystal [Digikey: 535-9869-6-ND] 25.0 MHz Surface Mount Crystal [Digikey: 535-9078-1-ND] 2.5 x 2.0mm - MEMs SMT Crystal 16.0 MHz 10pF 20ppm 2.5 x 2.0mm Crystal [Digikey -40-85°C: 535-10923-1-ND] 3.2 x 2.5mm - MEMs SMT Crystal 12.0 MHz 8pF 15ppm 3.2 x 2.5mm Crystal [Digikey: -10-70°C: 644-1047-1-ND -40-125°C: 644-1128-1-ND] 16.0 MHz 8pF 15ppm 3.2 x 2.5mm Crystal [Digikey: -10-70°C: 644-1049-1-ND -40-125°C: 644-1129-2-ND] 16.0 MHz 10pF 10ppm 3.2 x 2.5mm Crystal [Digikey: 644-1100-1-ND] 27.12 MHz 18pF 30ppm 3.2 x 2.5mm Crystal [Digikey: 887-1424-1-ND] 27.12MHz 10pF 10ppm 3.2 x 2.5mm Crystal [Digikey: 887-1329-1-ND] 4.9 x 1.8mm - MEMs SMT Crystal 32.768 KHz 12.5pF 20ppm 4.9 x 1.8mm Crystal [Digikey: SE2415CT-ND] 8.0 x 3.8mm - Surface Mount Crystal 32.768kHz 12.5pF 20ppm -40°C-85°C [Digikey: 535-9166-2-ND] Cylinder 32.768KHz Cylinder Crystal (2x6mm body) [Ex. Digikey: 300-8341-2-ND]